# Altium schematic sheet Block Diagram.SchDoc
size A4; SheetNumber: 3; SheetTotal: 9
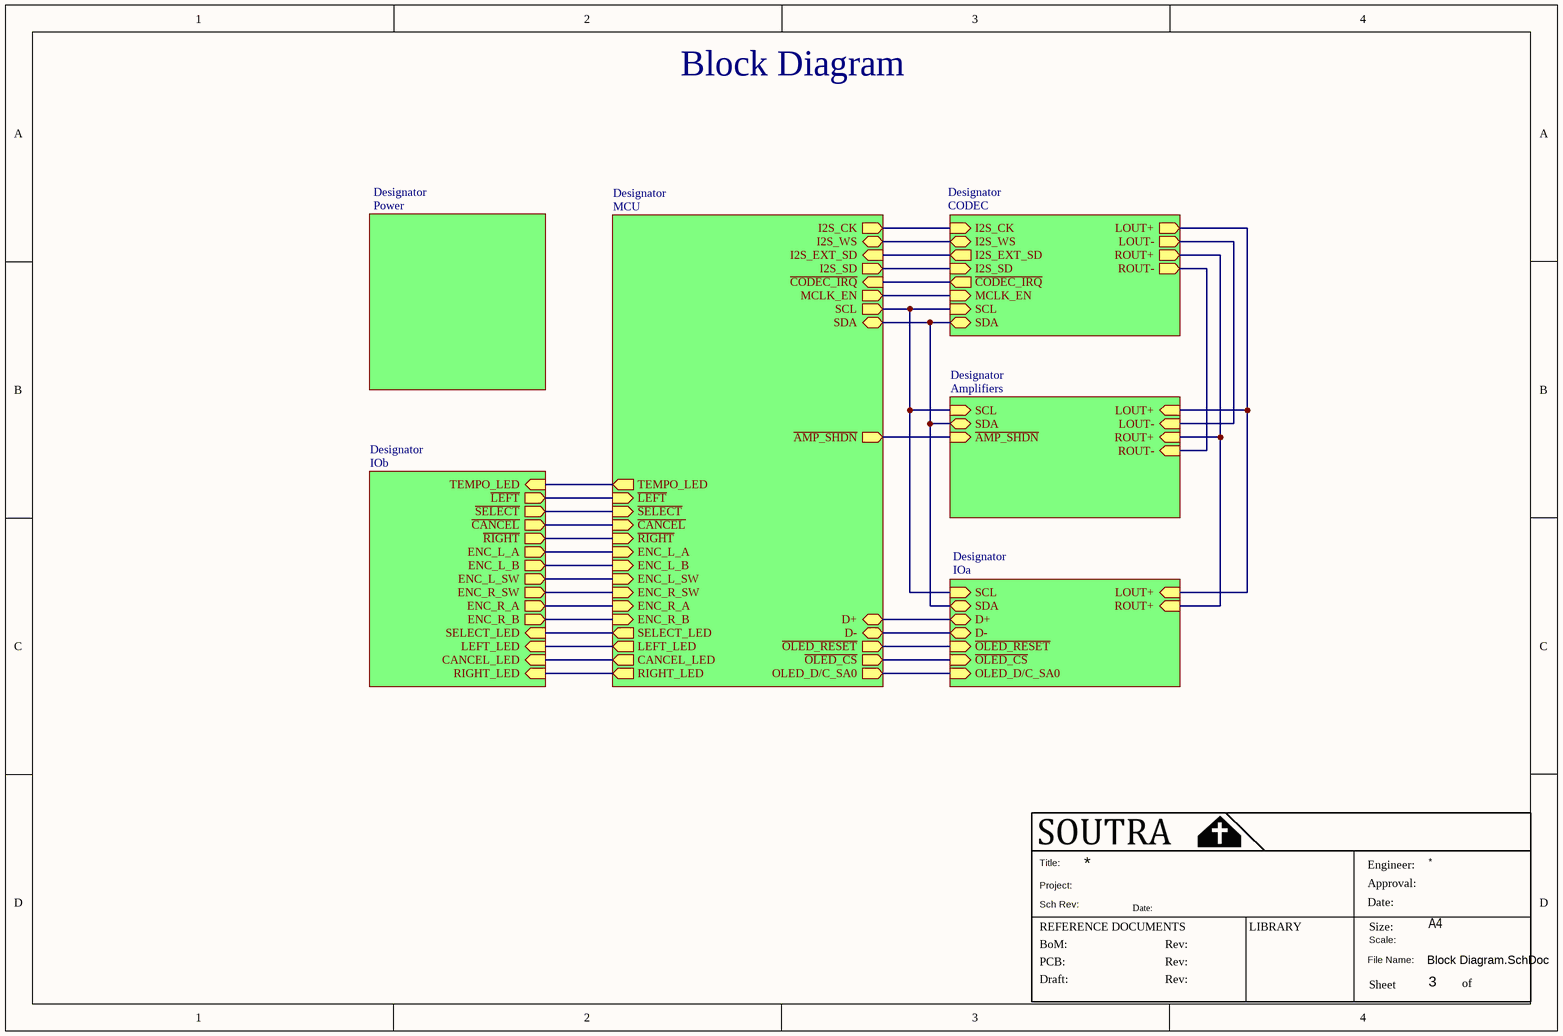
[diagram p0: Block Diagram.SchDoc]

## Sub-sheets
Designator = Power: no entries
Designator = CODEC: SCL (in), SDA (bidir), I2S_SD (in), I2S_EXT_SD (out), I2S_WS (bidir), I2S_CK (in), ~{CODEC_IRQ} (out), LOUT+ (out), LOUT- (out), ROUT+ (out), ROUT- (out), MCLK_EN (in)
Designator = MCU: D- (bidir), D+ (bidir), ENC_L_A (in), ENC_L_SW (in), ENC_L_B (in), RIGHT_LED (out), LEFT_LED (out), ~{LEFT} (in), ~{RIGHT} (in), ~{SELECT} (in), ENC_R_SW (in), ENC_R_A (in), ENC_R_B (in), SCL (out), SDA (bidir), ~{CANCEL} (in), TEMPO_LED (out), SELECT_LED (out), CANCEL_LED (out), I2S_SD (out), I2S_EXT_SD (in), I2S_WS (bidir), I2S_CK (out), ~{CODEC_IRQ} (in), MCLK_EN (out), ~{OLED_CS} (out), ~{OLED_RESET} (out), OLED_D/C_SA0 (out), ~{AMP_SHDN} (out)
Designator = Amplifiers: ROUT+ (in), ROUT- (in), ~{AMP_SHDN} (in), LOUT+ (in), SCL (in), SDA (bidir), LOUT- (in)
Designator = IOa: D- (bidir), D+ (bidir), LOUT+ (in), ROUT+ (in), ~{OLED_CS} (in), ~{OLED_RESET} (in), OLED_D/C_SA0 (in), SDA (bidir), SCL (in)
Designator = IOb: ~{LEFT} (out), ~{SELECT} (out), ~{CANCEL} (out), ~{RIGHT} (out), ENC_L_A (out), ENC_L_B (out), ENC_L_SW (out), ENC_R_SW (out), ENC_R_A (out), ENC_R_B (out), SELECT_LED (in), LEFT_LED (in), CANCEL_LED (in), RIGHT_LED (in), TEMPO_LED (in)

## Nets
(unnamed): sheet Designator/SCL, sheet Designator/SCL, sheet Designator/SCL, sheet Designator/SCL
(unnamed): sheet Designator/SDA, sheet Designator/SDA, sheet Designator/SDA, sheet Designator/SDA
(unnamed): sheet Designator/I2S_SD, sheet Designator/I2S_SD
(unnamed): sheet Designator/I2S_EXT_SD, sheet Designator/I2S_EXT_SD
(unnamed): sheet Designator/I2S_WS, sheet Designator/I2S_WS
(unnamed): sheet Designator/I2S_CK, sheet Designator/I2S_CK
(unnamed): sheet Designator/~{CODEC_IRQ}, sheet Designator/~{CODEC_IRQ}
(unnamed): sheet Designator/LOUT+, sheet Designator/LOUT+, sheet Designator/LOUT+
(unnamed): sheet Designator/LOUT-, sheet Designator/LOUT-
(unnamed): sheet Designator/ROUT+, sheet Designator/ROUT+, sheet Designator/ROUT+
(unnamed): sheet Designator/ROUT-, sheet Designator/ROUT-
(unnamed): sheet Designator/MCLK_EN, sheet Designator/MCLK_EN
(unnamed): sheet Designator/D-, sheet Designator/D-
(unnamed): sheet Designator/D+, sheet Designator/D+
(unnamed): sheet Designator/ENC_L_A, sheet Designator/ENC_L_A
(unnamed): sheet Designator/ENC_L_SW, sheet Designator/ENC_L_SW
(unnamed): sheet Designator/ENC_L_B, sheet Designator/ENC_L_B
(unnamed): sheet Designator/RIGHT_LED, sheet Designator/RIGHT_LED
(unnamed): sheet Designator/LEFT_LED, sheet Designator/LEFT_LED
(unnamed): sheet Designator/~{LEFT}, sheet Designator/~{LEFT}
(unnamed): sheet Designator/~{RIGHT}, sheet Designator/~{RIGHT}
(unnamed): sheet Designator/~{SELECT}, sheet Designator/~{SELECT}
(unnamed): sheet Designator/ENC_R_SW, sheet Designator/ENC_R_SW
(unnamed): sheet Designator/ENC_R_A, sheet Designator/ENC_R_A
(unnamed): sheet Designator/ENC_R_B, sheet Designator/ENC_R_B
(unnamed): sheet Designator/~{CANCEL}, sheet Designator/~{CANCEL}
(unnamed): sheet Designator/TEMPO_LED, sheet Designator/TEMPO_LED
(unnamed): sheet Designator/SELECT_LED, sheet Designator/SELECT_LED
(unnamed): sheet Designator/CANCEL_LED, sheet Designator/CANCEL_LED
(unnamed): sheet Designator/~{OLED_CS}, sheet Designator/~{OLED_CS}
(unnamed): sheet Designator/~{OLED_RESET}, sheet Designator/~{OLED_RESET}
(unnamed): sheet Designator/OLED_D/C_SA0, sheet Designator/OLED_D/C_SA0
(unnamed): sheet Designator/~{AMP_SHDN}, sheet Designator/~{AMP_SHDN}

## Notes on the sheet
- Block Diagram
- Title:
- Project:
- Sch Rev:
- Date:
- Engineer:
- Approval:
- REFERENCE DOCUMENTS
- BoM:
- PCB:
- Draft:
- Rev:
- LIBRARY
- File Name:
- Scale:
- Size:
- Sheet
- A4
- of